# EAGLE schematic Acumulator (EAGLE 6.6.0)

## Sheet 1 of 3
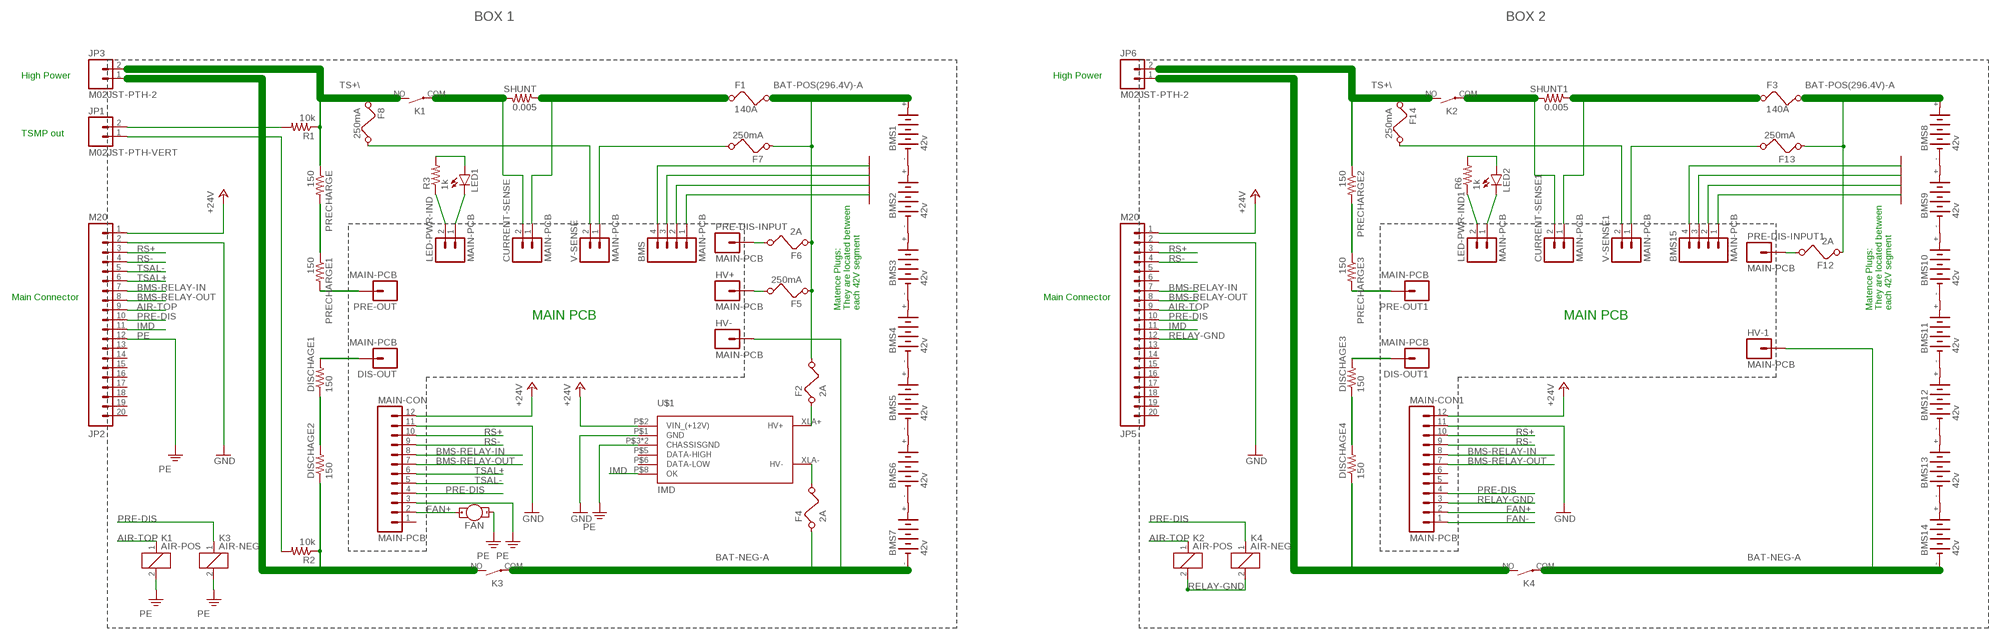
[diagram p0: schematic, sheet 1]

### Parts
BMS  MAIN-PCB  M04LOCK_LONGPADS  [1X04_LOCK_LONGPADS]
BMS1  42v  VST4V8  [VST4]
BMS2  42v  VST4V8  [VST4]
BMS3  42v  VST4V8  [VST4]
BMS4  42v  VST4V8  [VST4]
BMS5  42v  VST4V8  [VST4]
BMS6  42v  VST4V8  [VST4]
BMS7  42v  VST4V8  [VST4]
BMS8  42v  VST4V8  [VST4]
BMS9  42v  VST4V8  [VST4]
BMS10  42v  VST4V8  [VST4]
BMS11  42v  VST4V8  [VST4]
BMS12  42v  VST4V8  [VST4]
BMS13  42v  VST4V8  [VST4]
BMS14  42v  VST4V8  [VST4]
BMS15  MAIN-PCB  M04LOCK_LONGPADS  [1X04_LOCK_LONGPADS]
CURRENT-SENSE  MAIN-PCB  M02-JST-2-PTH-NO_SILK  [JST-2-PTH-NS]
CURRENT-SENSE1  MAIN-PCB  M02-JST-2-PTH-NO_SILK  [JST-2-PTH-NS]
DIS-OUT  MAIN-PCB  M01OFFSET  [1X01_OFFSET]
DIS-OUT1  MAIN-PCB  M01OFFSET  [1X01_OFFSET]
DISCHAGE1  150  2.0KOHM1/10W5%(0603)  [0603-RES]
DISCHAGE2  150  2.0KOHM1/10W5%(0603)  [0603-RES]
DISCHAGE3  150  2.0KOHM1/10W5%(0603)  [0603-RES]
DISCHAGE4  150  2.0KOHM1/10W5%(0603)  [0603-RES]
F1  140A  FUSE  [FUSE]
F2  2A  FUSE  [FUSE]
F3  140A  FUSE  [FUSE]
F4  2A  FUSE  [FUSE]
F5  250mA  FUSE  [FUSE]
F6  2A  FUSE  [FUSE]
F7  250mA  FUSE  [FUSE]
F8  250mA  FUSE  [FUSE]
F12  2A  FUSE  [FUSE]
F13  250mA  FUSE  [FUSE]
F14  250mA  FUSE  [FUSE]
FAN  MOTOR10MM  [VIBE-MOTOR-10MM]
HV+  MAIN-PCB  M01OFFSET  [1X01_OFFSET]
HV-  MAIN-PCB  M01OFFSET  [1X01_OFFSET]
HV-1  MAIN-PCB  M01OFFSET  [1X01_OFFSET]
JP1  M02JST-PTH-VERT  [JST-2-PTH-VERT]
JP2  M20  [1X20]
JP3  M02JST-PTH-2  [JST-2-PTH]
JP5  M20  [1X20]
JP6  M02JST-PTH-2  [JST-2-PTH]
K1  AIR-POS  APF30212A  [APF30212A]
K2  AIR-POS  APF30212A  [APF30212A]
K3  AIR-NEG  APF30212A  [APF30212A]
K4  AIR-NEG  APF30212A  [APF30212A]
LED1  LED5MM  [LED5MM]
LED2  LED5MM  [LED5MM]
LED-PWR-IND  MAIN-PCB  M02-JST-2-PTH-NO_SILK  [JST-2-PTH-NS]
LED-PWR-IND1  MAIN-PCB  M02-JST-2-PTH-NO_SILK  [JST-2-PTH-NS]
MAIN-CON  MAIN-PCB  M12LOCK  [1X12_LOCK]
MAIN-CON1  MAIN-PCB  M12LOCK  [1X12_LOCK]
PRE-DIS-INPUT  MAIN-PCB  M01OFFSET  [1X01_OFFSET]
PRE-DIS-INPUT1  MAIN-PCB  M01OFFSET  [1X01_OFFSET]
PRE-OUT  MAIN-PCB  M01OFFSET  [1X01_OFFSET]
PRE-OUT1  MAIN-PCB  M01OFFSET  [1X01_OFFSET]
PRECHARGE  150  2.0KOHM1/10W5%(0603)  [0603-RES]
PRECHARGE1  150  2.0KOHM1/10W5%(0603)  [0603-RES]
PRECHARGE2  150  2.0KOHM1/10W5%(0603)  [0603-RES]
PRECHARGE3  150  2.0KOHM1/10W5%(0603)  [0603-RES]
R1  10k  RESISTOR0805-RES  [0805]
R2  10k  RESISTOR0805-RES  [0805]
R3  1k  2.0KOHM1/10W5%(0603)  [0603-RES]
R6  1k  2.0KOHM1/10W5%(0603)  [0603-RES]
SHUNT  0.005  2.0KOHM1/10W5%(0603)  [0603-RES]
SHUNT1  0.005  2.0KOHM1/10W5%(0603)  [0603-RES]
U$1  IMD  [IMD]
V-SENSE  MAIN-PCB  M02-JST-2-PTH-NO_SILK  [JST-2-PTH-NS]
V-SENSE1  MAIN-PCB  M02-JST-2-PTH-NO_SILK  [JST-2-PTH-NS]

### Nets
+24V: JP2.1 JP5.1 MAIN-CON1.12 MAIN-CON.12 U$1.P$2(VIN_(+12V))
AIR-TOP: JP2.9 JP5.9 K1.1 K2.1 ; also sheet 2
BAT-NEG-A: BMS7.- BMS14.- F4.1 HV-1.1 HV-.1 K3.COM(2:P) K4.COM(2:P) ; also sheet 2
BAT-POS(296.4V)-A: BMS1.+ BMS8.+ F1.2 F2.2 F3.2 F5.1 F6.1 F7.1 F12.1 F13.1 ; also sheet 2
BMS-RELAY-IN: JP2.7 JP5.7 MAIN-CON1.8 MAIN-CON.8
BMS-RELAY-OUT: JP2.8 JP5.8 MAIN-CON1.7 MAIN-CON.7
FAN+: FAN.+ MAIN-CON1.2 MAIN-CON.2
FAN-: MAIN-CON1.1
GND: JP2.2 JP5.2 MAIN-CON1.11 MAIN-CON.11 U$1.P$1(GND)
IMD: JP2.11 JP5.11 U$1.P$8(OK)
MP1: BMS1.- BMS2.+
MP2: BMS8.- BMS9.+
N$1: JP1.2 R1.2
N$2: BMS2.- BMS3.+
N$3: PRECHARGE1.1 PRECHARGE.2
N$4: BMS3.- BMS4.+
N$5: PRE-OUT.1 PRECHARGE1.2
N$6: BMS4.- BMS5.+
N$7: JP1.1 R2.2
N$8: BMS5.- BMS6.+
N$9: DIS-OUT.1 DISCHAGE1.2
N$10: BMS6.- BMS7.+
N$11: F4.2 U$1.XLA-(HV-)
N$12: F2.1 U$1.XLA+(HV+)
N$13: CURRENT-SENSE.2 K1.COM(2:P) SHUNT.2
N$14: CURRENT-SENSE.1 F1.1 SHUNT.1
N$15: DISCHAGE1.1 DISCHAGE2.2
N$16: F5.2 HV+.1
N$17: LED-PWR-IND.2 R3.1
N$18: LED1.A R3.2
N$19: LED1.K(C) LED-PWR-IND.1
N$20: BMS9.- BMS10.+
N$21: F6.2 PRE-DIS-INPUT.1
N$22: F8.2 V-SENSE.2
N$23: F7.2 V-SENSE.1
N$24: BMS10.- BMS11.+
N$25: BMS11.- BMS12.+
N$26: BMS12.- BMS13.+
N$27: BMS13.- BMS14.+
N$32: CURRENT-SENSE1.2 K2.COM(2:P) SHUNT1.2
N$33: CURRENT-SENSE1.1 F3.1 SHUNT1.1
N$35: LED-PWR-IND1.2 R6.1
N$36: LED2.A R6.2
N$37: LED2.K(C) LED-PWR-IND1.1
N$38: F12.2 PRE-DIS-INPUT1.1
N$39: F13.2 V-SENSE1.1
N$40: F14.2 V-SENSE1.2
N$41: BMS15.1
N$42: BMS15.2
N$43: BMS15.3
N$44: BMS15.4
N$45: BMS.1
N$46: BMS.2
N$47: BMS.3
N$48: BMS.4
N$49: DISCHAGE2.1 JP3.1 K3.NO(2:S) R2.1
N$50: DISCHAGE4.1 JP6.1 K4.NO(2:S)
N$51: PRECHARGE2.2 PRECHARGE3.1
N$52: PRE-OUT1.1 PRECHARGE3.2
N$53: DIS-OUT1.1 DISCHAGE3.2
N$54: DISCHAGE3.1 DISCHAGE4.2
PE: FAN.- JP2.12 K1.2 K3.2 MAIN-CON.3 U$1.P$3(CHASSISGND) U$1.P$4(CHASSISGND) ; also sheet 2
PRE-DIS: JP2.10 JP5.10 K3.1 K4.1 MAIN-CON1.4 MAIN-CON.4
RELAY-GND: JP5.12 K2.2 K4.2 MAIN-CON1.3
RS+: JP2.3 JP5.3 MAIN-CON1.10 MAIN-CON.10
RS-: JP2.4 JP5.4 MAIN-CON1.9 MAIN-CON.9
TS+\: F8.1 F14.1 JP3.2 JP6.2 K1.NO(2:S) K2.NO(2:S) PRECHARGE2.1 PRECHARGE.1 R1.1 ; also sheet 2
TSAL+: JP2.6 MAIN-CON.6
TSAL-: JP2.5 MAIN-CON.5
Unconnected: BMS1.+@1(+) BMS2.+@1(+) BMS3.+@1(+) BMS4.+@1(+) BMS5.+@1(+) BMS6.+@1(+) BMS7.+@1(+) BMS8.+@1(+) BMS9.+@1(+) BMS10.+@1(+) BMS11.+@1(+) BMS12.+@1(+) BMS13.+@1(+) BMS14.+@1(+) JP2.13 JP2.14 JP2.15 JP2.16 JP2.17 JP2.18 JP2.19 JP2.20 JP5.5 JP5.6 JP5.13 JP5.14 JP5.15 JP5.16 JP5.17 JP5.18 JP5.19 JP5.20 MAIN-CON1.5 MAIN-CON1.6 MAIN-CON.1 U$1.P$5(DATA-HIGH) U$1.P$6(DATA-LOW)

### Notes on the sheet
- BOX 1 | BOX 2
- High Power | High Power
- TSMP out
- Main Connector | Main Connector
- Matence Plugs:
  They are located between
  each 42V segment
- Matence Plugs:
  They are located between
  each 42V segment
- MAIN PCB | MAIN PCB

## Sheet 2 of 3
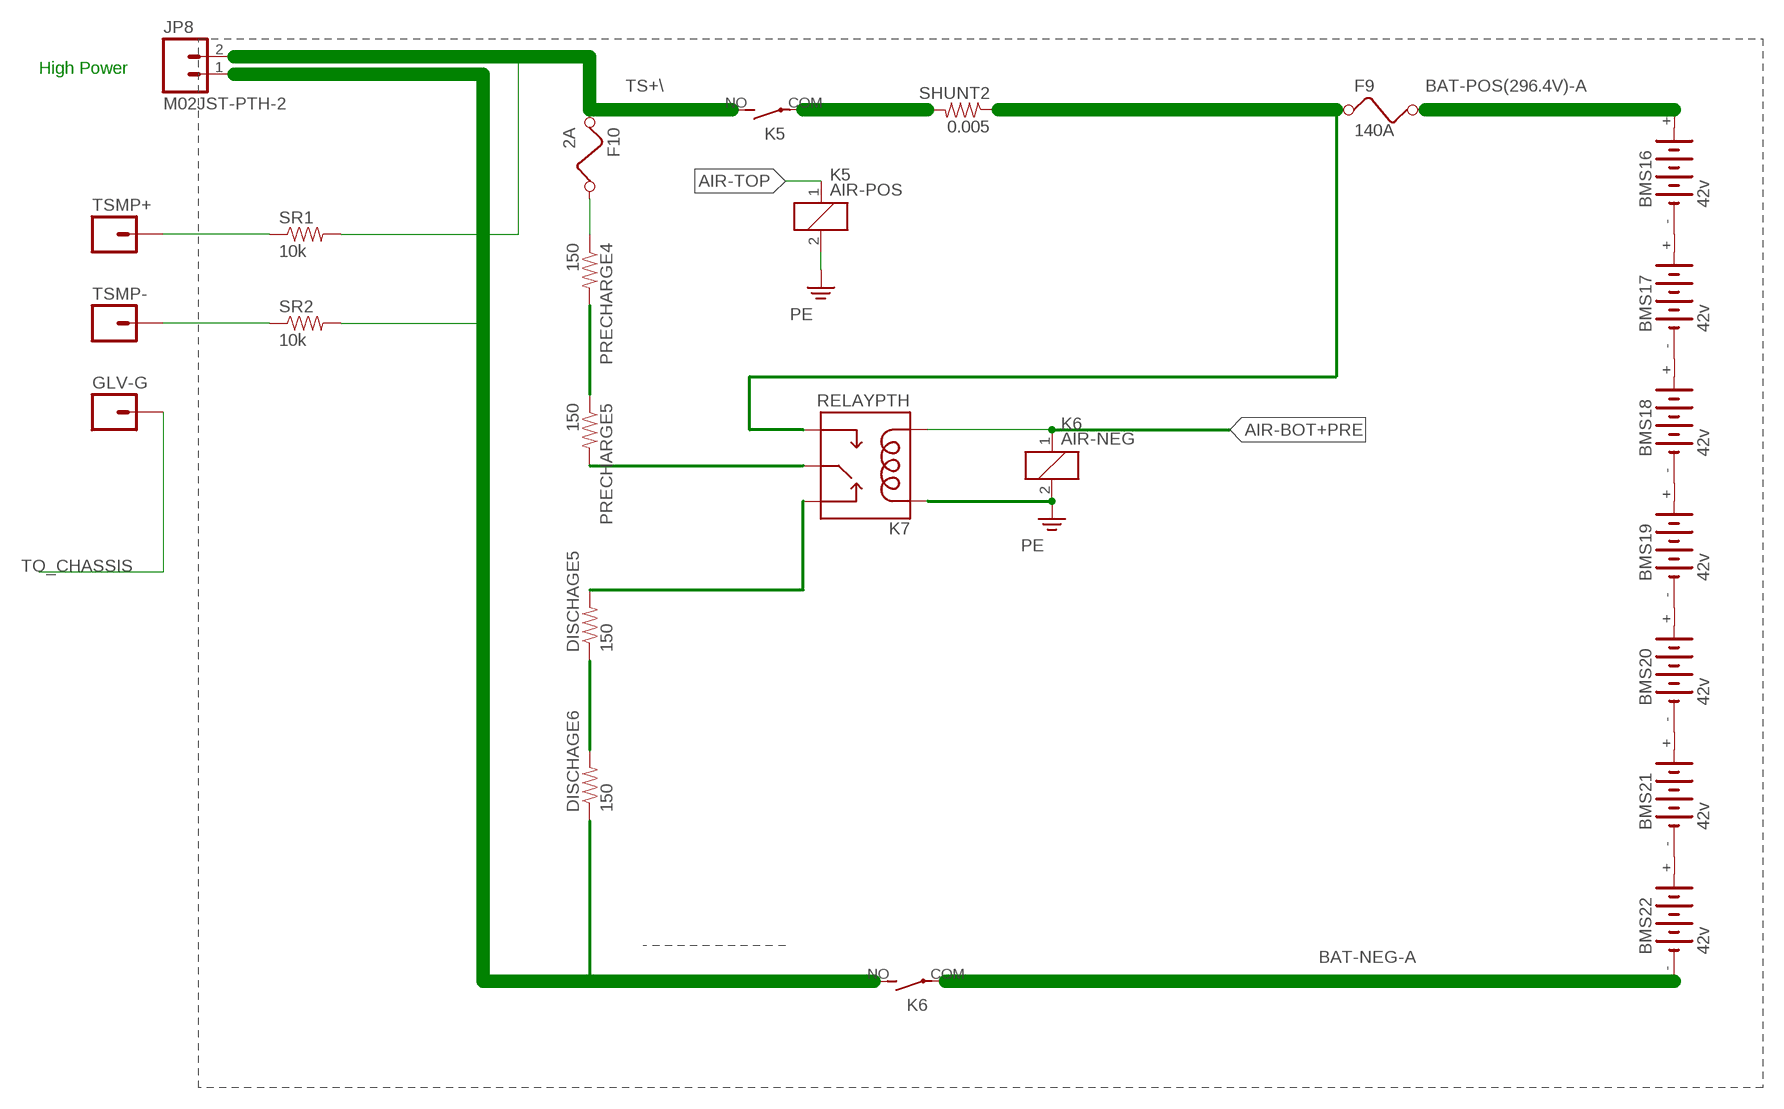
[diagram p1: schematic, sheet 2]

### Parts
BMS16  42v  VST4V8  [VST4]
BMS17  42v  VST4V8  [VST4]
BMS18  42v  VST4V8  [VST4]
BMS19  42v  VST4V8  [VST4]
BMS20  42v  VST4V8  [VST4]
BMS21  42v  VST4V8  [VST4]
BMS22  42v  VST4V8  [VST4]
DISCHAGE5  150  2.0KOHM1/10W5%(0603)  [0603-RES]
DISCHAGE6  150  2.0KOHM1/10W5%(0603)  [0603-RES]
F9  140A  FUSE  [FUSE]
F10  2A  FUSE  [FUSE]
GLV-G  M01-SMTSO-256-ET  [SMTSO-256-ET]
JP8  M02JST-PTH-2  [JST-2-PTH]
K5  AIR-POS  APF30212A  [APF30212A]
K6  AIR-NEG  APF30212A  [APF30212A]
K7  RELAYPTH  [RELAY-G5Q]
PRECHARGE4  150  2.0KOHM1/10W5%(0603)  [0603-RES]
PRECHARGE5  150  2.0KOHM1/10W5%(0603)  [0603-RES]
SHUNT2  0.005  2.0KOHM1/10W5%(0603)  [0603-RES]
SR1  10k  2.0KOHM1/10W5%(0603)  [0603-RES]
SR2  10k  2.0KOHM1/10W5%(0603)  [0603-RES]
TSMP+  M01-SMTSO-256-ET  [SMTSO-256-ET]
TSMP-  M01-SMTSO-256-ET  [SMTSO-256-ET]

### Nets
AIR-BOT+PRE: K6.1 K7.1(COIL2)
AIR-TOP: K5.1 ; also sheet 1
BAT-NEG-A: BMS22.- K6.COM(2:P) ; also sheet 1
BAT-POS(296.4V)-A: BMS16.+ F9.2 ; also sheet 1
MP3: BMS16.- BMS17.+
N$28: BMS17.- BMS18.+
N$29: BMS18.- BMS19.+
N$30: BMS19.- BMS20.+
N$31: BMS20.- BMS21.+
N$34: BMS21.- BMS22.+
N$55: SR1.1 TSMP+.P$1
N$56: F10.2 PRECHARGE4.1
N$57: SR2.1 TSMP-.P$1
N$59: K5.COM(2:P) SHUNT2.2
N$60: F9.1 K7.3(NO) SHUNT2.1
N$72: DISCHAGE6.1 JP8.1 K6.NO(2:S) SR2.2
N$73: PRECHARGE4.2 PRECHARGE5.1
N$74: K7.2(MAIN) PRECHARGE5.2
N$75: DISCHAGE5.2 K7.4(NC)
N$76: DISCHAGE5.1 DISCHAGE6.2
PE: K5.2 K6.2 K7.5(COIL1) ; also sheet 1
TO_CHASSIS: GLV-G.P$1
TS+\: F10.1 JP8.2 K5.NO(2:S) SR1.2 ; also sheet 1
Unconnected: BMS16.+@1(+) BMS17.+@1(+) BMS18.+@1(+) BMS19.+@1(+) BMS20.+@1(+) BMS21.+@1(+) BMS22.+@1(+)

### Notes on the sheet
- High Power

## Sheet 3 of 3
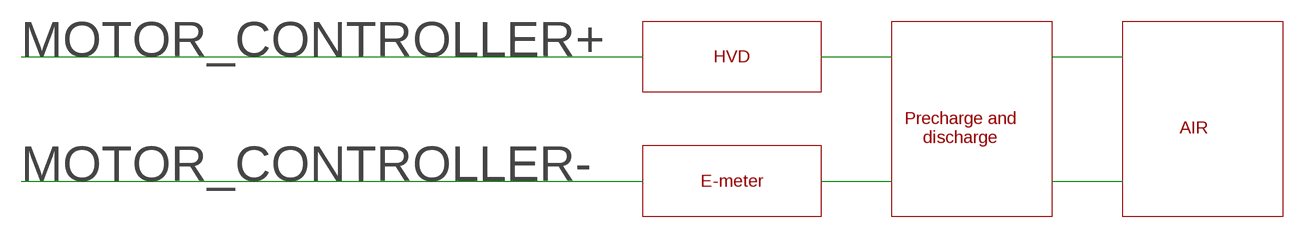
[diagram p2: schematic, sheet 3]

### Notes on the sheet
- HVD
- Precharge and 
  discharge
- AIR
- E-meter

## Library data of the parts
BMS BMS15 = SparkFun-Connectors:M04: Header 4 Standard 4-pin 0.1" header. Use with straight break away headers (SKU : PRT-00116), right angle break away headers (PRT-00553), swiss pins (PRT-00743), machine pins (PRT-00117), and female headers (PRT-00115). Molex polarized connector foot print use with SKU : PRT-08231 with associated crimp pins and housings. 1MM SMD Version SKU: PRT-10208
BMS1-BMS14 BMS16-BMS22 = battery:VST4V8: NC ACCU Varta Safe Tronic 4V8
CURRENT-SENSE CURRENT-SENSE1 JP1 LED-PWR-IND LED-PWR-IND1 V-SENSE V-SENSE1 = SparkFun-Connectors:M02: Standard 2-pin 0.1" header. Use with - straight break away headers ( PRT-00116) - right angle break away headers (PRT-00553) - swiss pins (PRT-00743) - machine pins (PRT-00117) - female headers (PRT-00115) Molex polarized connector foot print use with: PRT-08233 with associated crimp pins and housings. 2.54_SCREWTERM for use with PRT-10571. 3.5mm Screw Terminal footprints for PRT-08084 5mm Screw Terminal footprints for use with PRT-08432
DIS-OUT DIS-OUT1 GLV-G HV+ HV- HV-1 PRE-DIS-INPUT PRE-DIS-INPUT1 PRE-OUT PRE-OUT1 TSMP+ TSMP- = SparkFun-Connectors:M01: Header 1 Standard 1-pin 0.1" header. Use with straight break away headers (SKU : PRT-00116), right angle break away headers (PRT-00553), swiss pins (PRT-00743), machine pins (PRT-00117), and female headers (PRT-00115).
DISCHAGE1-DISCHAGE6 PRECHARGE PRECHARGE1-PRECHARGE5 R3 R6 SHUNT SHUNT1 SHUNT2 SR1 SR2 = SparkFun-Resistors:2.0KOHM1/10W5%(0603): RES-08296; PROD_ID: RES-08296; VALUE: 2.0k
F1-F10 F12-F14 = special:FUSE: FUSE 5 x 20 mm
FAN = SparkFun-Electromechanical:MOTOR: Vibration Motor- ROB-08449 Physical dimension and wire connections for this powerful vibration motor. Motor has a self adhesive backing.
JP2 JP5 = SparkFun-Connectors:M20: 1x20 .1" header This is just like the LOCK variant in that the holes are staggared by 5 mil, but except for the last two holes. They are not altered from the "standard" footprint layout. This is used for a special purpose on the layout of our Graphic LCD Backpack. Make sure you want to use this device before selecting it for you project!
JP3 JP6 JP8 = SparkFun-Connectors:M02: Standard 2-pin 0.1" header. Use with - straight break away headers ( PRT-00116) - right angle break away headers (PRT-00553) - swiss pins (PRT-00743) - machine pins (PRT-00117) - female headers (PRT-00115) Molex polarized connector foot print use with: PRT-08233 with associated crimp pins and housings. 2.54_SCREWTERM for use with PRT-10571. 3.5mm Screw Terminal footprints for PRT-08084 5mm Screw Terminal footprints for use with PRT-08432; PROD_ID: CONN-09863; SKU: PRT-09914
K1-K6 = relay:APF30212A: Compliant with European standards 1a/1c 6A Slim power relays Source: Data sheet <http://pewa.panasonic.com/assets/pcsd/catalog/pf-catalog.pdf>; OC_FARNELL: unknown
K7 = SparkFun-Electromechanical:RELAY: SPDT relay (COM-00101)
LED1 LED2 = SparkFun-LED:LED: LEDs Standard schematic elements and footprints for 5mm, 3mm, 1206, and 0603 sized LEDs. 5mm - Spark Fun Electronics SKU : COM-00529 (and others)
MAIN-CON MAIN-CON1 = SparkFun-Connectors:M12: Header 12 Standard 12-pin 0.1" header. Use with straight break away headers (SKU : PRT-00116), right angle break away headers (PRT-00553), swiss pins (PRT-00743), machine pins (PRT-00117), and female headers (PRT-00115).
R1 R2 = SparkFun-Passives:RESISTOR: Resistor Basic schematic elements and footprints for 0603, 1206, and PTH resistors.
U$1 = FSAE Eletric:IMD